# EAGLE design uartConverter (EAGLE 7.5.0)
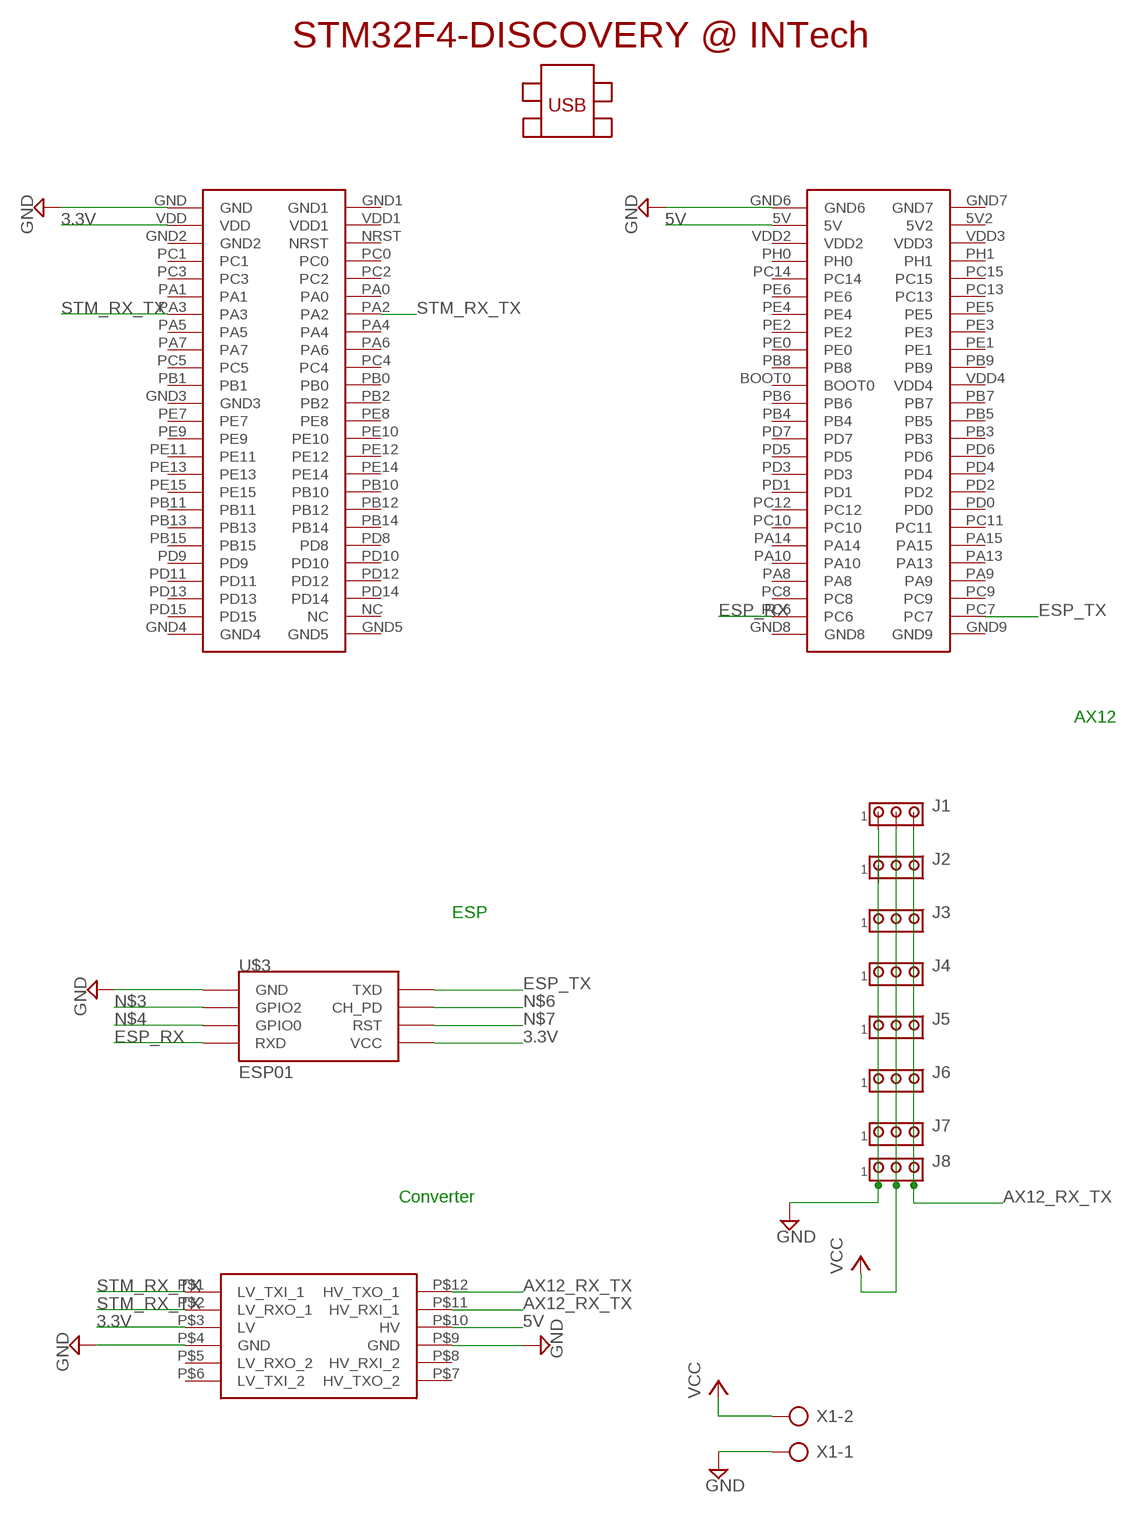
[diagram p0: schematic, sheet 1]

## Parts
J1  MTA03-100  [10X03MTA]
J2  MTA03-100  [10X03MTA]
J3  MTA03-100  [10X03MTA]
J4  MTA03-100  [10X03MTA]
J5  MTA03-100  [10X03MTA]
J6  MTA03-100  [10X03MTA]
J7  MTA03-100  [10X03MTA]
J8  MTA03-100  [10X03MTA]
U$1  LOGIC_LEVEL_CONVERTER  [LOGIC_LEVEL_CONVERTER]
U$2  STM32F4-DISCOVERY  [STM32F4-DISCOVERY]
U$3  ESP01  [ESP01]
X1  AK300/2  [AK300/2]

## Nets
3.3V: U$1.P$3(LV) U$2.VDD U$3.VCC
5V: U$1.P$10(HV) U$2.5V
AX12_RX_TX: J1.3 J2.3 J3.3 J4.3 J5.3 J6.3 J7.3 J8.3 U$1.P$11(HV_RXI_1) U$1.P$12(HV_TXO_1)
ESP_RX: U$2.PC6 U$3.RX(RXD)
ESP_TX: U$2.PC7 U$3.TX(TXD)
GND: J1.1 J2.1 J3.1 J4.1 J5.1 J6.1 J7.1 J8.1 U$1.P$4(GND) U$1.P$9(GND) U$2.GND U$2.GND6 U$3.GND X1.1
N$3: U$3.GPIO2
N$4: U$3.GPIO0
N$6: U$3.CH_PD
N$7: U$3.RST
STM_RX_TX: U$1.P$1(LV_TXI_1) U$1.P$2(LV_RXO_1) U$2.PA2 U$2.PA3
VCC: J1.2 J2.2 J3.2 J4.2 J5.2 J6.2 J7.2 J8.2 X1.2
Unconnected: U$1.P$5(LV_RXO_2) U$1.P$6(LV_TXI_2) U$1.P$7(HV_TXO_2) U$1.P$8(HV_RXI_2) U$2.5V2 U$2.BOOT0 U$2.GND1 U$2.GND2 U$2.GND3 U$2.GND4 U$2.GND5 U$2.GND7 U$2.GND8 U$2.GND9 U$2.NC U$2.NRST U$2.PA0 U$2.PA1 U$2.PA4 U$2.PA5 U$2.PA6 U$2.PA7 U$2.PA8 U$2.PA9 U$2.PA10 U$2.PA13 U$2.PA14 U$2.PA15 U$2.PB0 U$2.PB1 U$2.PB2 U$2.PB3 U$2.PB4 U$2.PB5 U$2.PB6 U$2.PB7 U$2.PB8 U$2.PB9 U$2.PB10 U$2.PB11 U$2.PB12 U$2.PB13 U$2.PB14 U$2.PB15 U$2.PC0 U$2.PC1 U$2.PC2 U$2.PC3 U$2.PC4 U$2.PC5 U$2.PC8 U$2.PC9 U$2.PC10 U$2.PC11 U$2.PC12 U$2.PC13 U$2.PC14 U$2.PC15 U$2.PD0 U$2.PD1 U$2.PD2 U$2.PD3 U$2.PD4 U$2.PD5 U$2.PD6 U$2.PD7 U$2.PD8 U$2.PD9 U$2.PD10 U$2.PD11 U$2.PD12 U$2.PD13 U$2.PD14 U$2.PD15 U$2.PE0 U$2.PE1 U$2.PE2 U$2.PE3 U$2.PE4 U$2.PE5 U$2.PE6 U$2.PE7 U$2.PE8 U$2.PE9 U$2.PE10 U$2.PE11 U$2.PE12 U$2.PE13 U$2.PE14 U$2.PE15 U$2.PH0 U$2.PH1 U$2.VDD1 U$2.VDD2 U$2.VDD3 U$2.VDD4

## Notes on the sheet
- AX12
- ESP
- Converter

## Library data of the parts
J1-J8 = con-amp:MTA03-100: AMP connector
U$1 = SparkFun-Boards:LOGIC_LEVEL_CONVERTER: Logic Level Converter (3.3v - 5v) https://www.sparkfun.com/products/8745
U$2 = STM32F4-DISCOVERY_CF_INTECH:STM32F4-DISCOVERY
U$3 = esp8266modules:ESP01: ESP8266 Wifi module 01
X1 = con-ptr500:AK300/2: CONNECTOR; OC_FARNELL: unknown; OC_NEWARK: unknown

## Board
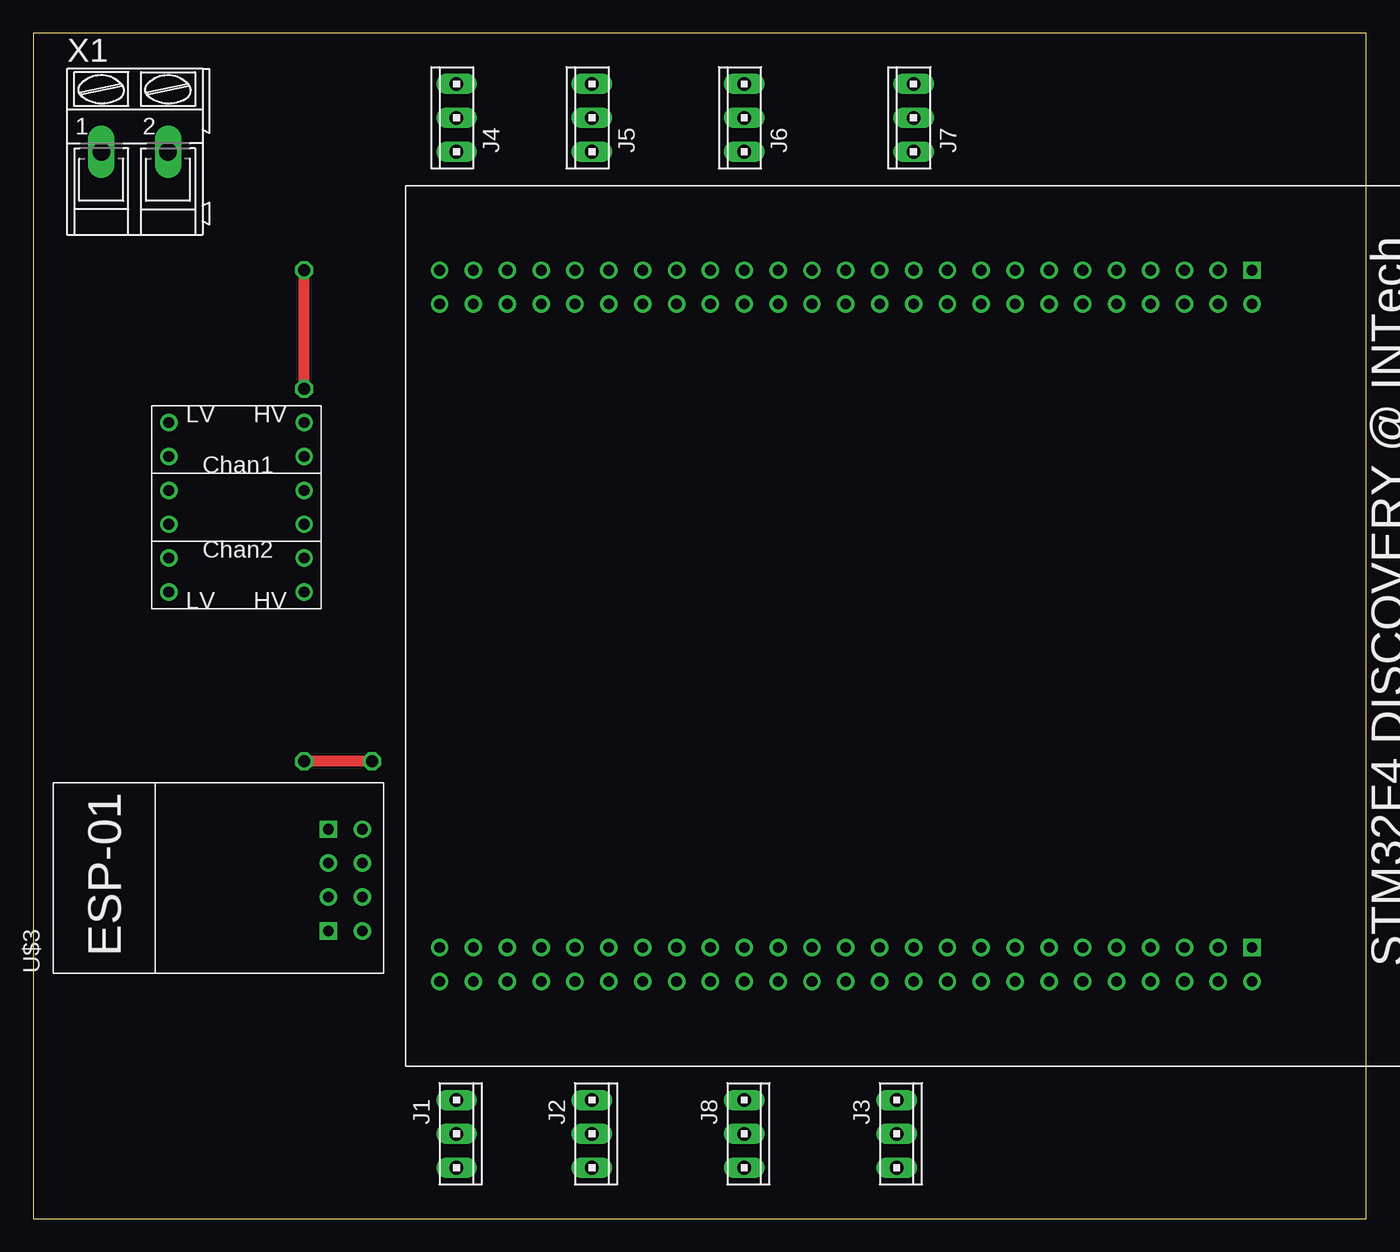
[diagram p1: board, top side]
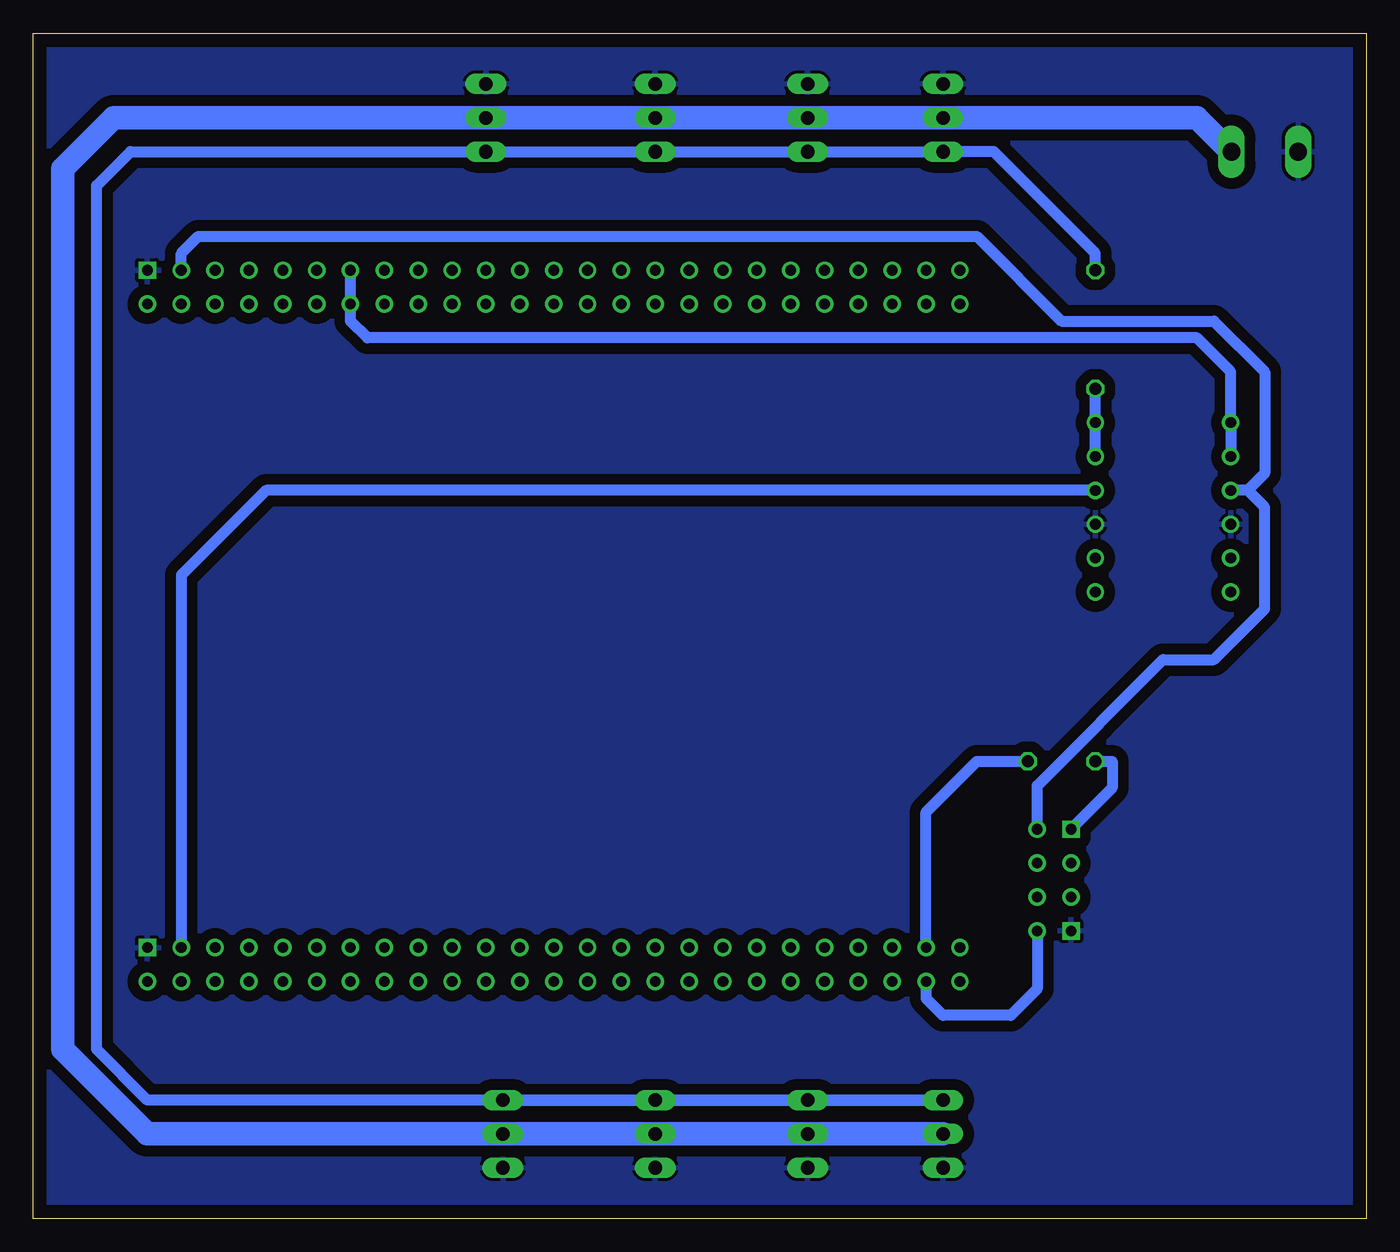
[diagram p2: board, bottom side, seen from below]

Size 100 x 88.89 mm. Coordinates in mm from the lower left corner, seen from the top.
Outline: 0,0 100,0 100,88.89 0,88.89 0,0
Copper layers (1*16): Top 0.035mm / dielectric 1.5mm / Bottom 0.035mm
Design rules "default": minimum track width 10mil, minimum drill 24mil, track to track 8mil, track to pad 8mil, pad to pad 8mil, via to via 8mil, smd to smd 8mil, copper to edge 40mil, drill to drill 8mil, minimum pad ring 10mil, minimum via ring 8mil, stop-mask expansion 4mil, vias tented up to drill 0mil, thermal gap 10mil

### Footprints (pad centres in the part's own frame; a part is rotated, then mirrored left to right if it is on the bottom)
10X03MTA = drill 1.016 long: 1 2.54,0; 2 0,0; 3 -2.54,0
LOGIC_LEVEL_CONVERTER = drill 0.8: P$1 1.27,13.97; P$2 1.27,11.43; P$3 1.27,8.89; P$4 1.27,6.35; P$5 1.27,3.81; P$6 1.27,1.27; P$7 11.43,1.27; P$8 11.43,3.81; P$9 11.43,6.35; P$10 11.43,8.89; P$11 11.43,11.43; P$12 11.43,13.97
STM32F4-DISCOVERY = drill 0.8: 5V 24.13,12.7; 5V2 26.67,12.7; BOOT0 24.13,-10.16; GND1 -24.13,15.24; GND2 -26.67,10.16; GND3 -26.67,-12.7; GND4 -26.67,-45.72; GND5 -24.13,-45.72; GND7 26.67,15.24; GND8 24.13,-45.72; GND9 26.67,-45.72; NC -24.13,-43.18; NRST -24.13,10.16; PA0 -24.13,2.54; PA1 -26.67,2.54; PA2 -24.13,0; PA3 -26.67,0; PA4 -24.13,-2.54; PA5 -26.67,-2.54; PA6 -24.13,-5.08; PA7 -26.67,-5.08; PA8 24.13,-38.1; PA9 26.67,-38.1; PA10 24.13,-35.56; PA13 26.67,-35.56; PA14 24.13,-33.02; PA15 26.67,-33.02; PB0 -24.13,-10.16; PB1 -26.67,-10.16; PB2 -24.13,-12.7; PB3 26.67,-17.78; PB4 24.13,-15.24; PB5 26.67,-15.24; PB6 24.13,-12.7; PB7 26.67,-12.7; PB8 24.13,-7.62; PB9 26.67,-7.62; PB10 -24.13,-25.4; PB11 -26.67,-27.94; PB12 -24.13,-27.94; PB13 -26.67,-30.48; PB14 -24.13,-30.48; PB15 -26.67,-33.02; PC0 -24.13,7.62; PC1 -26.67,7.62; PC2 -24.13,5.08; PC3 -26.67,5.08; PC4 -24.13,-7.62; PC5 -26.67,-7.62; PC6 24.13,-43.18; PC7 26.67,-43.18; PC8 24.13,-40.64; PC9 26.67,-40.64; PC10 24.13,-30.48; PC11 26.67,-30.48; PC12 24.13,-27.94; PC13 26.67,2.54; PC14 24.13,5.08; PC15 26.67,5.08; PD0 26.67,-27.94; PD1 24.13,-25.4; PD2 26.67,-25.4; PD3 24.13,-22.86; PD4 26.67,-22.86; PD5 24.13,-20.32; PD6 26.67,-20.32; PD7 24.13,-17.78; PD8 -24.13,-33.02; PD9 -26.67,-35.56; PD10 -24.13,-35.56; PD11 -26.67,-38.1; PD12 -24.13,-38.1; PD13 -26.67,-40.64; PD14 -24.13,-40.64; PD15 -26.67,-43.18; PE0 24.13,-5.08; PE1 26.67,-5.08; PE2 24.13,-2.54; PE3 26.67,-2.54; PE4 24.13,0; PE5 26.67,0; PE6 24.13,2.54; PE7 -26.67,-15.24; PE8 -24.13,-15.24; PE9 -26.67,-17.78; PE10 -24.13,-17.78; PE11 -26.67,-20.32; PE12 -24.13,-20.32; PE13 -26.67,-22.86; PE14 -24.13,-22.86; PE15 -26.67,-25.4; PH0 24.13,7.62; PH1 26.67,7.62; VDD -26.67,12.7; VDD1 -24.13,12.7; VDD2 24.13,10.16; VDD3 26.67,10.16; VDD4 26.67,-10.16 | drill 0.8 square: GND -26.67,15.24; GND6 24.13,15.24
ESP01 = drill 0.8: CH_PD -1.285,-8.178; GPIO0 1.255,-5.638; GPIO2 -1.285,-5.638; RST 1.255,-8.178; TX -3.825,-8.178; VCC 3.795,-8.178 | drill 0.8 square: GND -3.825,-5.638; RX 3.795,-5.638
AK300/2 = drill 1.321 long: 1 -2.515,0; 2 2.489,0

### Placement (x,y rotation side)
J1  31.75,6.35 270 top
J2  41.91,6.35 270 top
J3  64.77,6.35 270 top
J4  31.75,82.55 90 top
J5  41.91,82.55 90 top
J6  53.34,82.55 90 top
J7  66.04,82.55 90 top
J8  53.34,6.35 270 top
U$1  8.89,45.72 0 top
U$2  76.2,44.45 270 top
U$3  16.51,25.4 90 top
X1  7.62,80.01 0 top

### Tracks (layer width: path | path; a pad name or v marks a point on that pad's centre or on a via)
3.3V
  Bottom 0.813: U$3.VCC 24.69,32.46 15.24,41.91 11.43,41.91 7.62,45.72 7.62,53.34 8.89,54.61 | 8.89,54.61 U$1.P$3 | U$2.VDD 88.9,72.39 87.63,73.66 29.21,73.66 22.86,67.31 11.43,67.31 7.62,63.5 7.62,55.88 8.89,54.61
5V
  Bottom 0.813: U$1.P$10 82.55,54.61 88.9,48.26 U$2.5V
AX12_RX_TX  (via drill 0.9)
  Top 0.813: v20.32,62.23 v20.32,71.12
  Bottom 0.813: U$1.P$11 U$1.P$12 v20.32,62.23 | v20.32,71.12 20.32,72.39 27.94,80.01 J4.3 J5.3 J6.3 J7.3 92.71,80.01 95.25,77.47 95.25,12.7 91.44,8.89 J1.3 J2.3 J8.3 J3.3
ESP_RX  (via drill 0.9)
  Top 0.813: v25.4,34.29 v20.32,34.29
  Bottom 0.813: U$2.PC6 33.02,30.48 29.21,34.29 v25.4,34.29 | v20.32,34.29 19.05,34.29 19.05,32.29 U$3.RX
ESP_TX
  Bottom 0.813: U$2.PC7 33.02,16.51 31.75,15.24 26.67,15.24 24.69,17.22 U$3.TX
GND
  pour Bottom (isolate 0.813): -1.27,92.71 101.6,92.71 101.6,-1.27 -1.27,-1.27
STM_RX_TX
  Bottom 0.813: U$1.P$2 U$1.P$1 10.16,63.5 12.7,66.04 74.93,66.04 76.2,67.31 U$2.PA2 U$2.PA3
VCC
  Bottom 1.778: X1.2 10.16,80.01 12.7,82.55 J4.2 J5.2 J6.2 J7.2 93.98,82.55 97.79,78.74 97.79,12.7 91.44,6.35 J3.2 J8.2 J2.2 J1.2